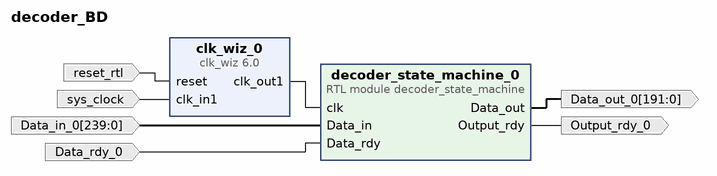
[diagram p0: block diagram of the top level]
# Vivado block design decoder_BD, xc7z020clg400-1, Vivado 2023.1
create_bd_design decoder_BD

create_bd_port -dir I -type clk sys_clock
set_property -dict {CONFIG.FREQ_HZ 125000000 CONFIG.PHASE 0.0} [get_bd_ports sys_clock]
create_bd_port -dir I -type rst reset_rtl
set_property -dict {CONFIG.POLARITY ACTIVE_HIGH} [get_bd_ports reset_rtl]
create_bd_port -dir I -from 239 -to 0 Data_in_0
create_bd_port -dir O -from 191 -to 0 Data_out_0
create_bd_port -dir I Data_rdy_0
create_bd_port -dir O Output_rdy_0

create_bd_cell -type ip -vlnv xilinx.com:ip:clk_wiz:6.0 clk_wiz_0
set_property -dict {CONFIG.CLK_IN1_BOARD_INTERFACE sys_clock CONFIG.USE_BOARD_FLOW true} [get_bd_cells clk_wiz_0]
create_bd_cell -type module -reference decoder_state_machine decoder_state_machine_0

# ---- connections ----

connect_bd_net -net Data_in_0_1 [get_bd_ports Data_in_0] [get_bd_pins decoder_state_machine_0/Data_in]
connect_bd_net -net Data_rdy_0_1 [get_bd_ports Data_rdy_0] [get_bd_pins decoder_state_machine_0/Data_rdy]
connect_bd_net [get_bd_pins clk_wiz_0/clk_out1] [get_bd_pins decoder_state_machine_0/clk]
connect_bd_net [get_bd_pins decoder_state_machine_0/Data_out] [get_bd_ports Data_out_0]
connect_bd_net [get_bd_pins decoder_state_machine_0/Output_rdy] [get_bd_ports Output_rdy_0]
connect_bd_net [get_bd_ports reset_rtl] [get_bd_pins clk_wiz_0/reset]
connect_bd_net [get_bd_ports sys_clock] [get_bd_pins clk_wiz_0/clk_in1]

validate_bd_design
save_bd_design
